# Altium project ATMEGA328.PrjPcb
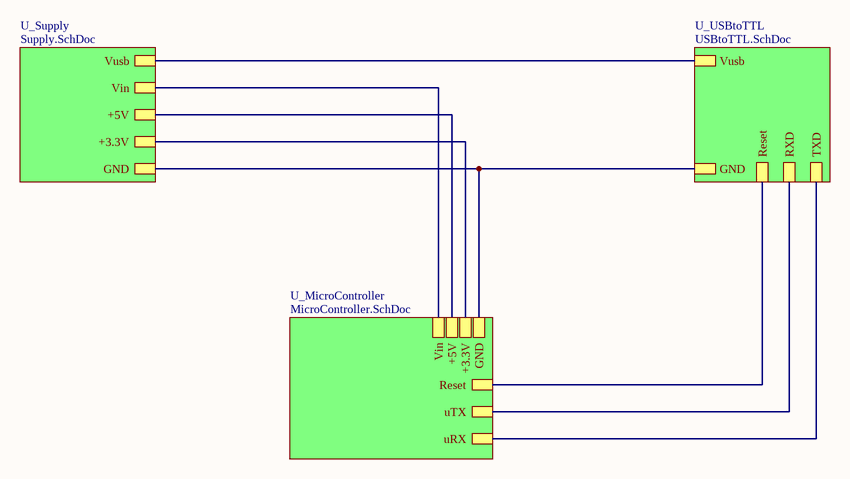
[diagram p0: Main.SchDoc]
CompanyName: github.com/aKaReZa75; Project_Name: ATMEGA328 EB; Revision: 1.1
4 sheets, 57 parts. Net scope: strictly hierarchical (ports join the sheet entries above them; power ports are local).
Board file: PCB.PcbDoc
Sheets:
  Main.SchDoc
    U_Supply = Supply.SchDoc
    U_USBtoTTL = USBtoTTL.SchDoc
    U_MicroController = MicroController.SchDoc

## Sheet Main.SchDoc: Main
size A4; SheetNumber: 1; SheetTotal: 4

### Sub-sheets
U_MicroController = MicroController.SchDoc: +3.3V, GND, +5V, Vin, Reset, uRX, uTX
U_Supply = Supply.SchDoc: +3.3V, GND, Vusb, +5V, Vin
U_USBtoTTL = USBtoTTL.SchDoc: Reset, TXD, RXD, Vusb, GND

### Nets
+3.3: sheet U_Supply/+3.3V, sheet U_MicroController/+3.3V
+5: sheet U_Supply/+5V, sheet U_MicroController/+5V
GND: sheet U_Supply/GND, sheet U_USBtoTTL/GND, sheet U_MicroController/GND
Vin: sheet U_Supply/Vin, sheet U_MicroController/Vin
Vusb: sheet U_Supply/Vusb, sheet U_USBtoTTL/Vusb
PD0: sheet U_USBtoTTL/TXD, sheet U_MicroController/uRX
PD1: sheet U_USBtoTTL/RXD, sheet U_MicroController/uTX
Reset: sheet U_USBtoTTL/Reset, sheet U_MicroController/Reset

### Notes on the sheet
- Title:
- Project:
- Drawn by:
- Revision:
- Hossein Bagheri
- Company:
- Sheet
- of

## Sheet Supply.SchDoc: Supply
size A4; SheetNumber: 3; SheetTotal: 4
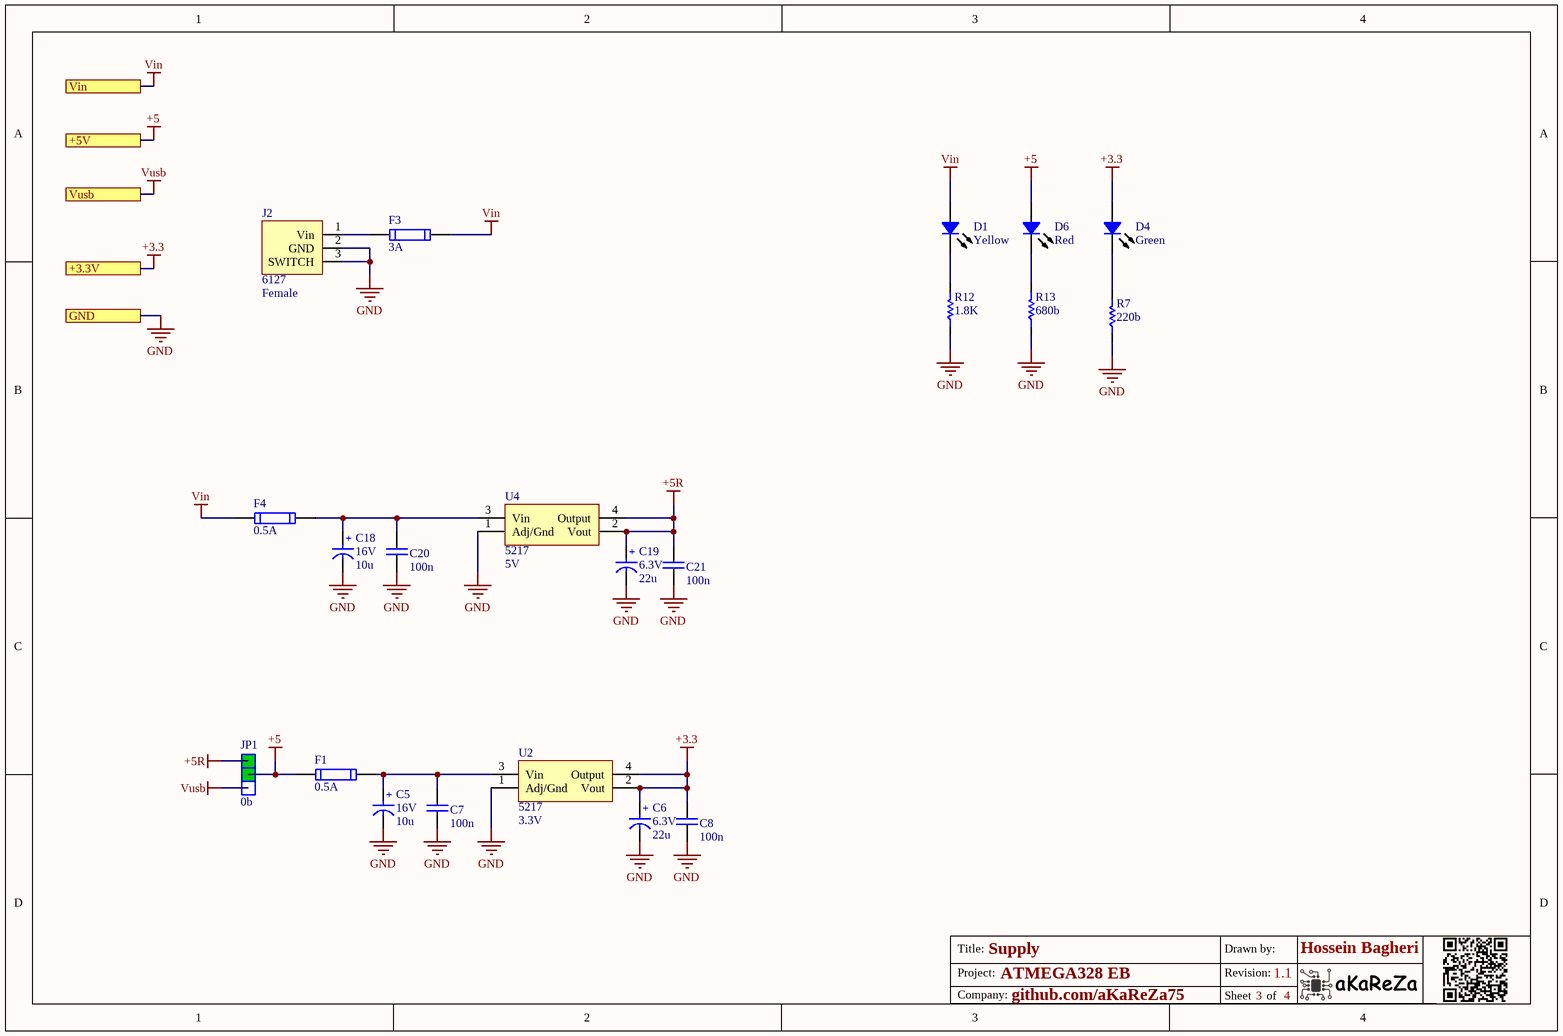
[diagram p1: Supply.SchDoc]

### Parts
C5  Rating: 16V  [SMT_C_Tantalum_A]  (hidden comment: 10u)
C6  Rating: 6.3V  [SMT_C_Tantalum_A]  (hidden comment: 22u)
C7  100n  [CAP 1206/3216]
C8  100n  [CAP 1206/3216]
C18  Rating: 16V  [SMT_C_Tantalum_A]  (hidden comment: 10u)
C19  Rating: 6.3V  [SMT_C_Tantalum_A]  (hidden comment: 22u)
C20  100n  [CAP 1206/3216]
C21  100n  [CAP 1206/3216]
D1  Yellow  [LED 0805/2012 YELLOW]
D4  Green  [LED 0805/2012 GREEN]
D6  Red  [LED 0805/2012 RED]
F1  0.5A  [1206_F]
F3  3A  [1206_F]
F4  0.5A  [1206_F]
J2  Inflow: 6127  [Power Jack BIG]  (hidden comment: Female)
JP1  0b  [jumper selector]
R7  220b  [RES 0805 (2012X06L)]
R12  1.8K  [RES 0805 (2012X06L)]
R13  680b  [RES 0805 (2012X06L)]
U2  Inflow: 5217  [SOT223_M]  (hidden comment: 3.3V)
U4  Inflow: 5217  [SOT223_M]  (hidden comment: 5V)

### Ports
+3.3V, +5V, GND, Vin, Vusb

### Nets
+3.3: C6.1(+) C8.1 D4.1 U2.2(Vout) U2.4(Output) ; port +3.3V
+5: D6.1 F1.1 JP1.2 ; port +5V
+5R: C19.1(+) C21.1 JP1.1 U4.2(Vout) U4.4(Output)
GND: C5.2(-) C6.2(-) C7.2 C8.2 C18.2(-) C19.2(-) C20.2 C21.2 J2.2(GND) J2.3(SWITCH) R7.1 R12.1 R13.1 U2.1(Adj/Gnd) U4.1(Adj/Gnd) ; port GND
Vin: D1.1 F3.2 F4.1 ; port Vin
Vusb: JP1.3 ; port Vusb
NetC5_1: C5.1(+) C7.1 F1.2 U2.3(Vin)
NetC18_1: C18.1(+) C20.1 F4.2 U4.3(Vin)
NetD1_2: D1.2 R12.2
NetD4_2: D4.2 R7.2
NetD6_2: D6.2 R13.2
NetF3_1: F3.1 J2.1(Vin)

### Notes on the sheet
- Title:
- Project:
- Drawn by:
- Revision:
- Hossein Bagheri
- Company:
- Sheet
- of

### Library data of the parts
C5 C6 C18 C19 = Cap_Tantalum: Tantalum Capacitor,TAJ Series-SMD; Inflow: inflow?; Validation: Valid; Package: Package?; Type: Tantalum
  C5 C18: Value: 10u
  C6 C19: Value: 22u
C7 C8 C20 C21 = Cap_Multi_SMD_100nF_1206: Bipolar ceramic capacitor SMD; Type: MultiLayer; Inflow: inflow?; Rating: 50V; Validation: Valid; Package: 1206; Value: 100n
D1 D4 D6 = Semi_LED_SMD: LED; Inflow: inflow?; Rating: Rating?; Validation: Valid; Package: Package?; Type: LED
  D1: Value: Yellow
  D4: Value: Green
  D6: Value: Red
F1 F3 F4 = Other_Elec_Fuse_SMD: Short circiut  protection; Inflow: inflow?; Type: Fast; Rating: Rating?; Validation: Valid; Package: 1206
  F1 F4: Value: 0.5A
  F3: Value: 3A
J2 = Con_Power_Jack: Power Jack; Rating: Rating?; Validation: Valid; Type: Type?; Package: Package?; Value: Female
JP1 = SW_Other_JSelector_Dip: Jumper Selector; Rating: Rating?; Inflow: 5145; Validation: NT; Package: Dip; Type: Selector; Value: 0b
R7 R12 R13 = Res_SMD_0805: Resistor; Inflow: inflow?; Rating: 0.125W; Validation: Valid; Package: 0805; Type: 10%
  R7: Value: 220b
  R12: Value: 1.8K
  R13: Value: 680b
U2 U4 = IC_Reg_AMS1117_3.3: 1'A Positive voltage regulator; Rating: 1A; Validation: Valid; Type: LDO; Package: SOT223
  U2: Value: 3.3V
  U4: Value: 5V

## Sheet USBtoTTL.SchDoc: USBtoTTL
size A4; SheetNumber: 4; SheetTotal: 4
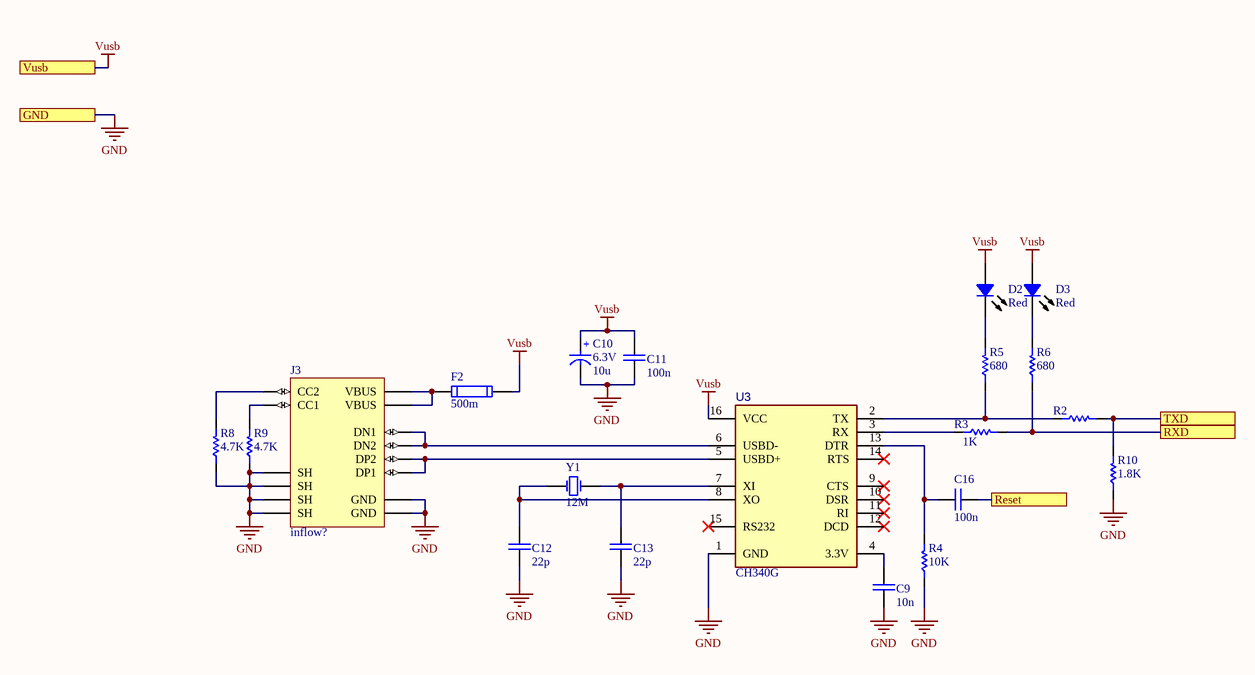
[diagram p2: USBtoTTL.SchDoc]

### Parts
C9  10n  [CAP 0805/2012]
C10  Rating: 6.3V  [SMT_C_Tantalum_A]  (hidden comment: 10u)
C11  100n  [CAP 0805/2012]
C12  22p  [CAP 0805/2012]
C13  22p  [CAP 0805/2012]
C16  100n  [CAP 0805/2012]
D2  Red  [LED 0805/2012 RED]
D3  Red  [LED 0805/2012 RED]
F2  500m  [1206_F]
J3  Inflow: inflow?  [HRO_TYPE-C-31-M-12 - Extended]  (hidden comment: 12b)
R2  1K  [RES 0805 (2012X06L)]  (value not drawn)
R3  1K  [RES 0805 (2012X06L)]
R4  10K  [RES 0805 (2012X06L)]
R5  680  [RES 0805 (2012X06L)]
R6  680  [RES 0805 (2012X06L)]
R8  4.7K  [RES 0805 (2012X06L)]
R9  4.7K  [RES 0805 (2012X06L)]
R10  1.8K  [RES 0805 (2012X06L)]
U3  CH340G  [SO16_M]
Y1  12M  [Crystal SMD]

### Ports
GND, Reset, RXD, TXD, Vusb

### Nets
GND: C9.2 C10.2(-) C11.2 C12.2 C13.2 J3.A1_B12(GND) J3.B1_A12(GND) J3.S1(SH) J3.S2(SH) J3.S3(SH) J3.S4(SH) R4.1 R8.1 R9.1 R10.1 U3.1(GND) ; port GND
Vusb: C10.1(+) C11.1 D2.1 D3.1 F2.2 U3.16(VCC) ; port Vusb
PD0: R2.2 R10.2 ; port TXD
PD1: R3.2 R6.1 ; port RXD
Reset: C16.2 ; port Reset
NetC9_1: C9.1 U3.4(3.3V)
NetC12_1: C12.1 U3.8(XO) Y1.1(OSC1)
NetC13_1: C13.1 U3.7(XI) Y1.2(OSC2)
NetC16_1: C16.1 R4.2 U3.13(DTR)
NetD2_2: D2.2 R5.2
NetD3_2: D3.2 R6.2
NetF2_1: F2.1 J3.A4_B9(VBUS) J3.B4_A9(VBUS)
NetJ3_A5: J3.A5(CC1) R9.2
NetJ3_A6: J3.A6(DP1) J3.B6(DP2) U3.5(USBD+)
NetJ3_A7: J3.A7(DN1) J3.B7(DN2) U3.6(USBD-)
NetJ3_B5: J3.B5(CC2) R8.2
NetR2_1: R2.1 R5.1 U3.2(TX)
NetR3_1: R3.1 U3.3(RX)

Not connected (* = marked no-connect by the designer): U3 9(CTS)* 10(DSR)* 11(RI)* 12(DCD)* 14(RTS)* 15(RS232)*

### Notes on the sheet
- Title:
- Project:
- Drawn by:
- Revision:
- Hossein Bagheri
- Company:
- Sheet
- of

### Library data of the parts
C9 C12 C13 = Cap_Multi_SMD_0805: Bipolar ceramic capacitor SMD; Inflow: inflow?; Type: MultiLayer; Rating: Rating?; Validation: Valid; Package: 0805
  C9: Value: 10n
  C12 C13: Value: 22p
C10 = Cap_Tantalum: as C5 on sheet Supply; Package: Package?; Type: Tantalum; Value: 10u
C11 C16 = Cap_Multi_SMD_100nF_0805: Bipolar ceramic capacitor SMD; Inflow: inflow?; Type: MultiLayer; Rating: 50V; Validation: Valid; Package: 0805; Value: 100n
D2 D3 = Semi_LED_SMD: as D1 on sheet Supply; Package: Package?; Type: LED; Value: Red
F2 = Other_Elec_Fuse_SMD: as F1 on sheet Supply; Package: 1206; Value: 500m
J3 = Con_USB_C: USB C Female Connector; Rating: Rating?; Validation: Valid; Value: 12b; Package: SMD; Type: C
R2-R6 R8-R10 = Res_SMD_0805: as R7 on sheet Supply; Package: 0805; Type: 10%
  R2 R3: Value: 1K
  R4: Value: 10K
  R5 R6: Value: 680
  R8 R9: Value: 4.7K
  R10: Value: 1.8K
U3 = IC_Converter_CH340G: TTL To USB Chip; Rating: Rating?; Validation: Valid; Inflow: inflow?; Type: USB to TTL; Package: SO-16; Value: CH340G
Y1 = Other_Elec_Xtal_SMD: Crystal Oscillator; Rating: Rating?; Inflow: inflow?; Validation: Valid; Package: SMD; Type: Quartz; Value: 12M

## Sheet MicroController.SchDoc: MicroController
size A4; Revision: 1.1; SheetNumber: 2; SheetTotal: 4
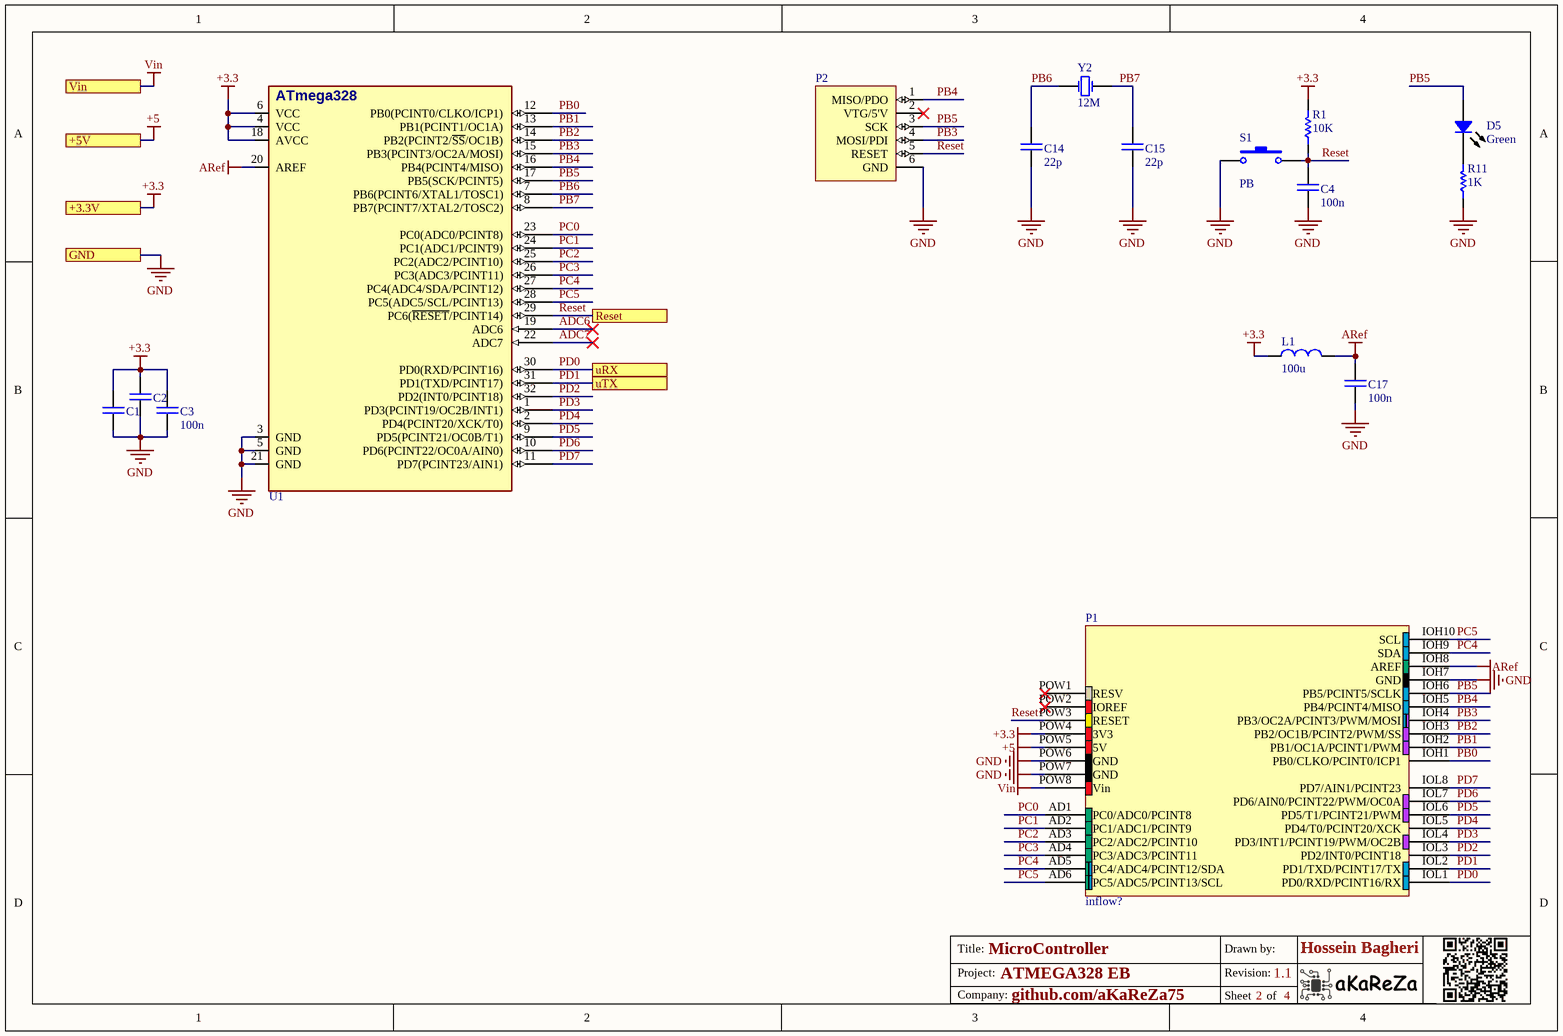
[diagram p3: MicroController.SchDoc]

### Parts
C1  100n  [CAP 0805/2012]  (value not drawn)
C2  100n  [CAP 0805/2012]  (value not drawn)
C3  100n  [CAP 0805/2012]
C4  100n  [CAP 0805/2012]
C14  22p  [CAP 0805/2012]
C15  22p  [CAP 0805/2012]
C17  100n  [CAP 0805/2012]
D5  Green  [LED 0805/2012 GREEN]
L1  100u  [IND0805]
P1  Inflow: inflow?  [ARDUINO_UNO_CONNECTOR]  (hidden comment: UNO)
P2  3x2  [IDC_2X3]  (value not drawn)
R1  10K  [RES 0805 (2012X06L)]
R11  1K  [RES 0805 (2012X06L)]
S1  PB  [SW_PB_SMD_2PIN_SPST_6X3X2]
U1  ATmega328P  [ATMEGA328]  (value not drawn)
Y2  12M  [Crystal SMD]

### Ports
+3.3V, +5V, GND, Reset, uRX, uTX, Vin

### Nets
+3.3: C1.1 C2.1 C3.1 L1.1 P1.POW4(3V3) R1.2 U1.4(VCC) U1.6(VCC) U1.18(AVCC) ; port +3.3V
+5: P1.POW5(5V) ; port +5V
ARef: C17.1 L1.2 P1.IOH8(AREF) U1.20(AREF)
GND: C1.2 C2.2 C3.2 C4.2 C14.2 C15.2 C17.2 P1.IOH7(GND) P1.POW6(GND) P1.POW7(GND) P2.6(GND) R11.1 S1.1 U1.3(GND) U1.5(GND) U1.21(GND) ; port GND
Vin: P1.POW8(Vin) ; port Vin
ADC6: U1.19(ADC6)
ADC7: U1.22(ADC7)
PB0: P1.IOH1(PB0/CLKO/PCINT0/ICP1) U1.12(PB0(PCINT0/CLKO/ICP1))
PB1: P1.IOH2(PB1/OC1A/PCINT1/PWM) U1.13(PB1(PCINT1/OC1A))
PB2: P1.IOH3(PB2/OC1B/PCINT2/PWM/SS) U1.14(PB2(PCINT2/~{SS}/OC1B))
PB3: P1.IOH4(PB3/OC2A/PCINT3/PWM/MOSI) P2.4(MOSI/PDI) U1.15(PB3(PCINT3/OC2A/MOSI))
PB4: P1.IOH5(PB4/PCINT4/MISO) P2.1(MISO/PDO) U1.16(PB4(PCINT4/MISO))
PB5: D5.1 P1.IOH6(PB5/PCINT5/SCLK) P2.3(SCK) U1.17(PB5(SCK/PCINT5))
PB6: C14.1 U1.7(PB6(PCINT6/XTAL1/TOSC1)) Y2.1(OSC1)
PB7: C15.1 U1.8(PB7(PCINT7/XTAL2/TOSC2)) Y2.2(OSC2)
PC0: P1.AD1(PC0/ADC0/PCINT8) U1.23(PC0(ADC0/PCINT8))
PC1: P1.AD2(PC1/ADC1/PCINT9) U1.24(PC1(ADC1/PCINT9))
PC2: P1.AD3(PC2/ADC2/PCINT10) U1.25(PC2(ADC2/PCINT10))
PC3: P1.AD4(PC3/ADC3/PCINT11) U1.26(PC3(ADC3/PCINT11))
PC4: P1.AD5(PC4/ADC4/PCINT12/SDA) P1.IOH9(SDA) U1.27(PC4(ADC4/SDA/PCINT12))
PC5: P1.AD6(PC5/ADC5/PCINT13/SCL) P1.IOH10(SCL) U1.28(PC5(ADC5/SCL/PCINT13))
PD0: P1.IOL1(PD0/RXD/PCINT16/RX) U1.30(PD0(RXD/PCINT16)) ; port uRX
PD1: P1.IOL2(PD1/TXD/PCINT17/TX) U1.31(PD1(TXD/PCINT17)) ; port uTX
PD2: P1.IOL3(PD2/INT0/PCINT18) U1.32(PD2(INT0/PCINT18))
PD3: P1.IOL4(PD3/INT1/PCINT19/PWM/OC2B) U1.1(PD3(PCINT19/OC2B/INT1))
PD4: P1.IOL5(PD4/T0/PCINT20/XCK) U1.2(PD4(PCINT20/XCK/T0))
PD5: P1.IOL6(PD5/T1/PCINT21/PWM) U1.9(PD5(PCINT21/OC0B/T1))
PD6: P1.IOL7(PD6/AIN0/PCINT22/PWM/OC0A) U1.10(PD6(PCINT22/OC0A/AIN0))
PD7: P1.IOL8(PD7/AIN1/PCINT23) U1.11(PD7(PCINT23/AIN1))
Reset: C4.1 P1.POW3(RESET) P2.5(RESET) R1.1 S1.2 U1.29(PC6(~{RESET}/PCINT14)) ; port Reset
NetD5_2: D5.2 R11.2

Not connected (* = marked no-connect by the designer): P1 POW1(RESV)* POW2(IOREF)*; P2 2(VTG/5'V)*

### Notes on the sheet
- Title:
- Project:
- Drawn by:
- Revision:
- Hossein Bagheri
- Company:
- Sheet
- of
- (in symbol IC_MCU_ATmega328P_SMD) ATmega328

### Library data of the parts
C1-C4 C17 = Cap_Multi_SMD_100nF_0805: as C11 on sheet USBtoTTL; Package: 0805; Value: 100n
C14 C15 = Cap_Multi_SMD_0805: as C9 on sheet USBtoTTL; Package: 0805; Value: 22p
D5 = Semi_LED_SMD: as D1 on sheet Supply; Package: Package?; Type: LED; Value: Green
L1 = Ind_SMD_0805: Inductor; Inflow: inflow?; Type: SMD; Rating: Rating?; Validation: Valid; Package: 0805; Value: 100u
P1 = Con_Arduino_UNO_Con: Arduino UNO Connector; Rating: Rating?; Validation: NT; Value: UNO; Package: Package?; Type: Type?
P2 = Con_Prog_MKII_ISP: 6 Pin Standard ISP Header For MKII; Rating: Rating?; Validation: NT; Inflow: inflow?; Value: 3x2; Package: Package?; Type: Type?
R1 R11 = Res_SMD_0805: as R7 on sheet Supply; Package: 0805; Type: 10%
  R1: Value: 10K
  R11: Value: 1K
S1 = SW_PushButton_2_SMD: SMT Tactile ‎Switch; Rating: 2b; Validation: Valid; Inflow: 8260; Type: Vertical; Package: SMD; Value: PB
U1 = IC_MCU_ATmega328P_SMD: 8-Bit AVR Microcontroller with 32K Bytes of In-System Programmable Flash Memory; Rating: Rating?; Validation: Valid; Inflow: inflow?; Value: ATmega328P; Package: Package?; Type: Type?
Y2 = Other_Elec_Xtal_SMD: as Y1 on sheet USBtoTTL; Package: SMD; Type: Quartz; Value: 12M

## Nets that join several sheets
+3.3: Supply (5 pins), MicroController (9 pins)
+5: Supply (D6.1 F1.1 JP1.2), MicroController (P1.POW5)
GND: Supply (15 pins), USBtoTTL (16 pins), MicroController (16 pins)
Vin: Supply (D1.1 F3.2 F4.1), MicroController (P1.POW8)
Vusb: Supply (JP1.3), USBtoTTL (6 pins)
PD0: USBtoTTL (R2.2 R10.2), MicroController (P1.IOL1 U1.30)
PD1: USBtoTTL (R3.2 R6.1), MicroController (P1.IOL2 U1.31)
Reset: USBtoTTL (C16.2), MicroController (6 pins)